# EAGLE design dual-dac-w-32-ch-sh (EAGLE 7.2.0)
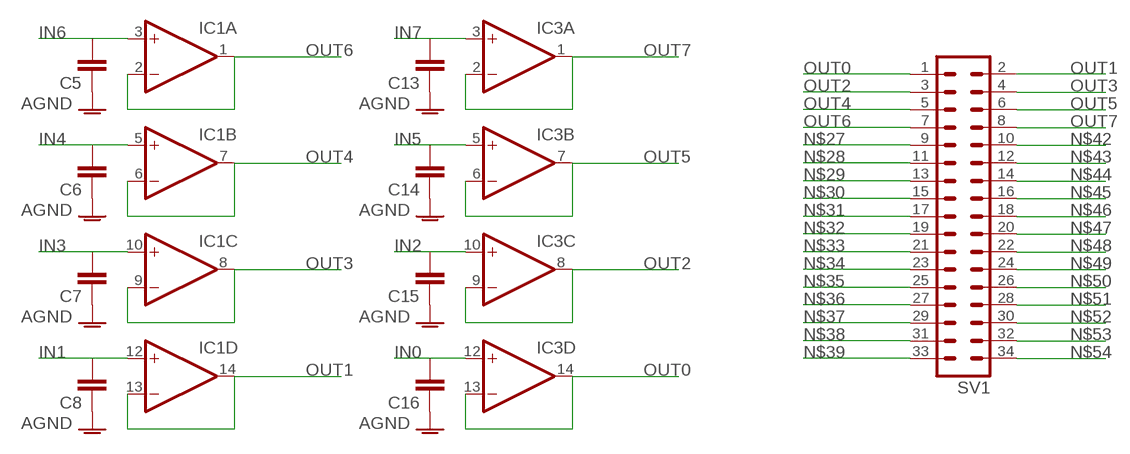
[diagram p0: schematic, sheet 1]

## Parts
C5  C-EUC1206  [C1206]
C6  C-EUC1206  [C1206]
C7  C-EUC1206  [C1206]
C8  C-EUC1206  [C1206]
C13  C-EUC1206  [C1206]
C14  C-EUC1206  [C1206]
C15  C-EUC1206  [C1206]
C16  C-EUC1206  [C1206]
IC1  TL074D  [SO14]
IC3  TL074D  [SO14]
SV1  MA17-2  [MA17-2]

## Nets
AGND: C5.1 C6.1 C7.1 C8.1 C13.1 C14.1 C15.1 C16.1
IN0: C16.2 IC3.12(D:+IN)
IN1: C8.2 IC1.12(D:+IN)
IN2: C15.2 IC3.10(C:+IN)
IN3: C7.2 IC1.10(C:+IN)
IN4: C6.2 IC1.5(B:+IN)
IN5: C14.2 IC3.5(B:+IN)
IN6: C5.2 IC1.3(A:+IN)
IN7: C13.2 IC3.3(A:+IN)
N$27: SV1.9
N$28: SV1.11
N$29: SV1.13
N$30: SV1.15
N$31: SV1.17
N$32: SV1.19
N$33: SV1.21
N$34: SV1.23
N$35: SV1.25
N$36: SV1.27
N$37: SV1.29
N$38: SV1.31
N$39: SV1.33
N$42: SV1.10
N$43: SV1.12
N$44: SV1.14
N$45: SV1.16
N$46: SV1.18
N$47: SV1.20
N$48: SV1.22
N$49: SV1.24
N$50: SV1.26
N$51: SV1.28
N$52: SV1.30
N$53: SV1.32
N$54: SV1.34
OUT0: IC3.13(D:-IN) IC3.14(D:OUT) SV1.1
OUT1: IC1.13(D:-IN) IC1.14(D:OUT) SV1.2
OUT2: IC3.8(C:OUT) IC3.9(C:-IN) SV1.3
OUT3: IC1.8(C:OUT) IC1.9(C:-IN) SV1.4
OUT4: IC1.6(B:-IN) IC1.7(B:OUT) SV1.5
OUT5: IC3.6(B:-IN) IC3.7(B:OUT) SV1.6
OUT6: IC1.1(A:OUT) IC1.2(A:-IN) SV1.7
OUT7: IC3.1(A:OUT) IC3.2(A:-IN) SV1.8

## Power pins joined to a net without a drawn wire
V+: IC1.4(P:V+) IC3.4(P:V+)
V-: IC1.11(P:V-) IC3.11(P:V-)

## Library data of the parts
C5-C8 C13-C16 = resistor:C-EU: CAPACITOR, European symbol
IC1 IC3 = linear:TL074: OP AMP
SV1 = con-lstb:MA17-2: PIN HEADER; OC_FARNELL: unknown; OC_NEWARK: unknown

## Board
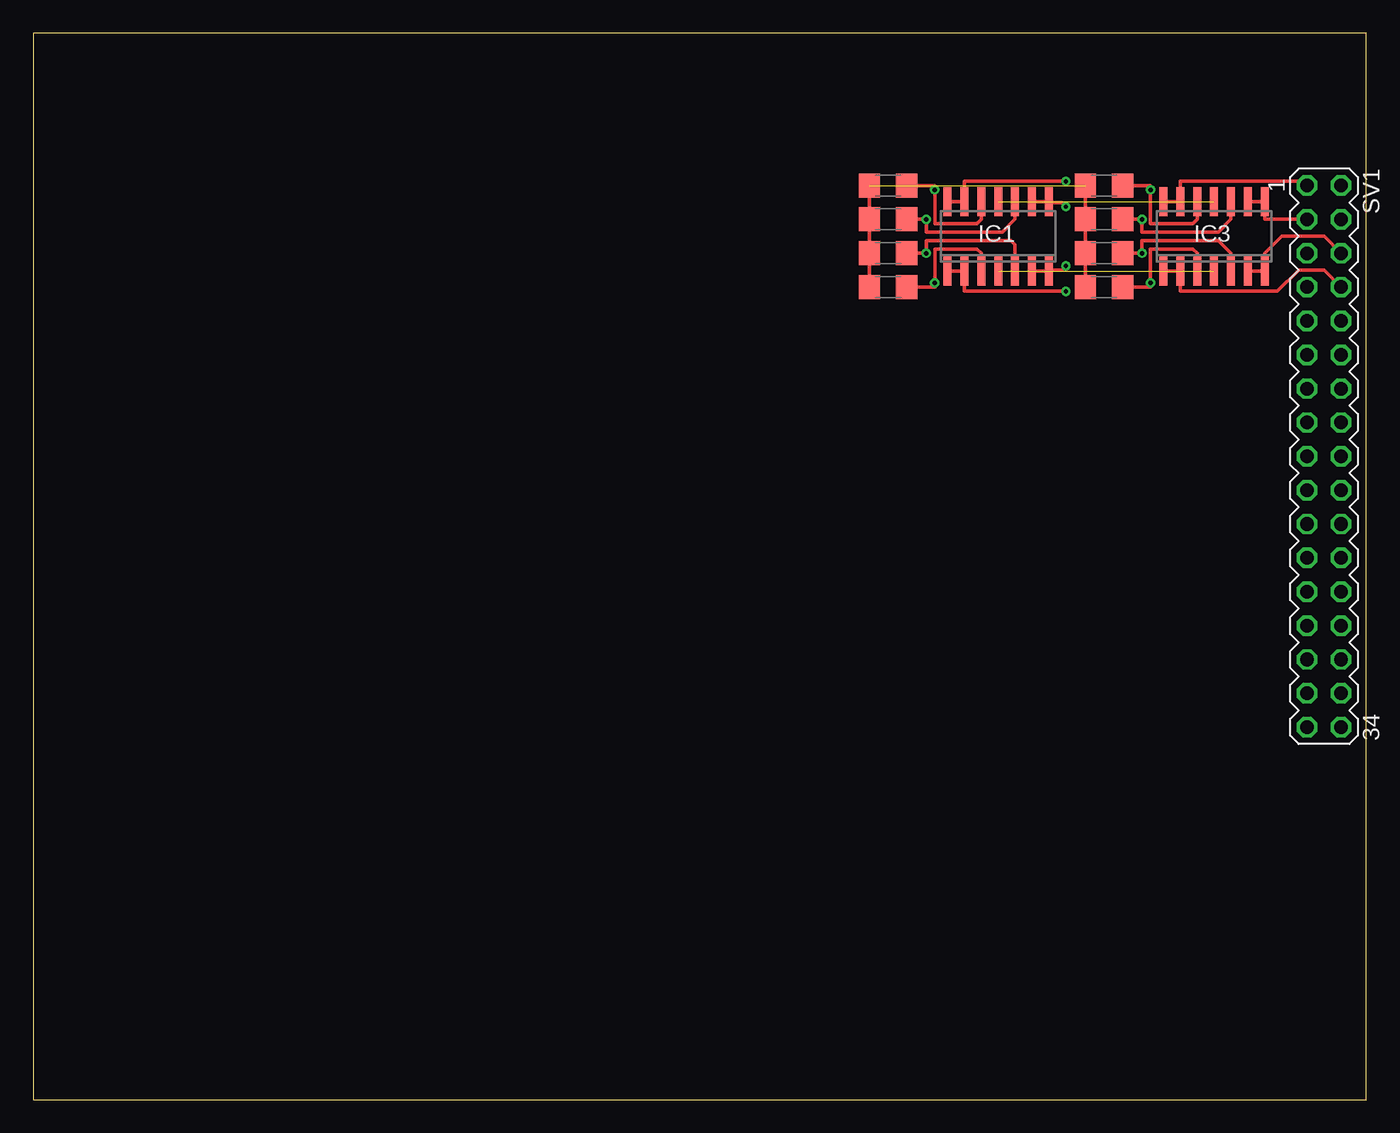
[diagram p1: board, top side]
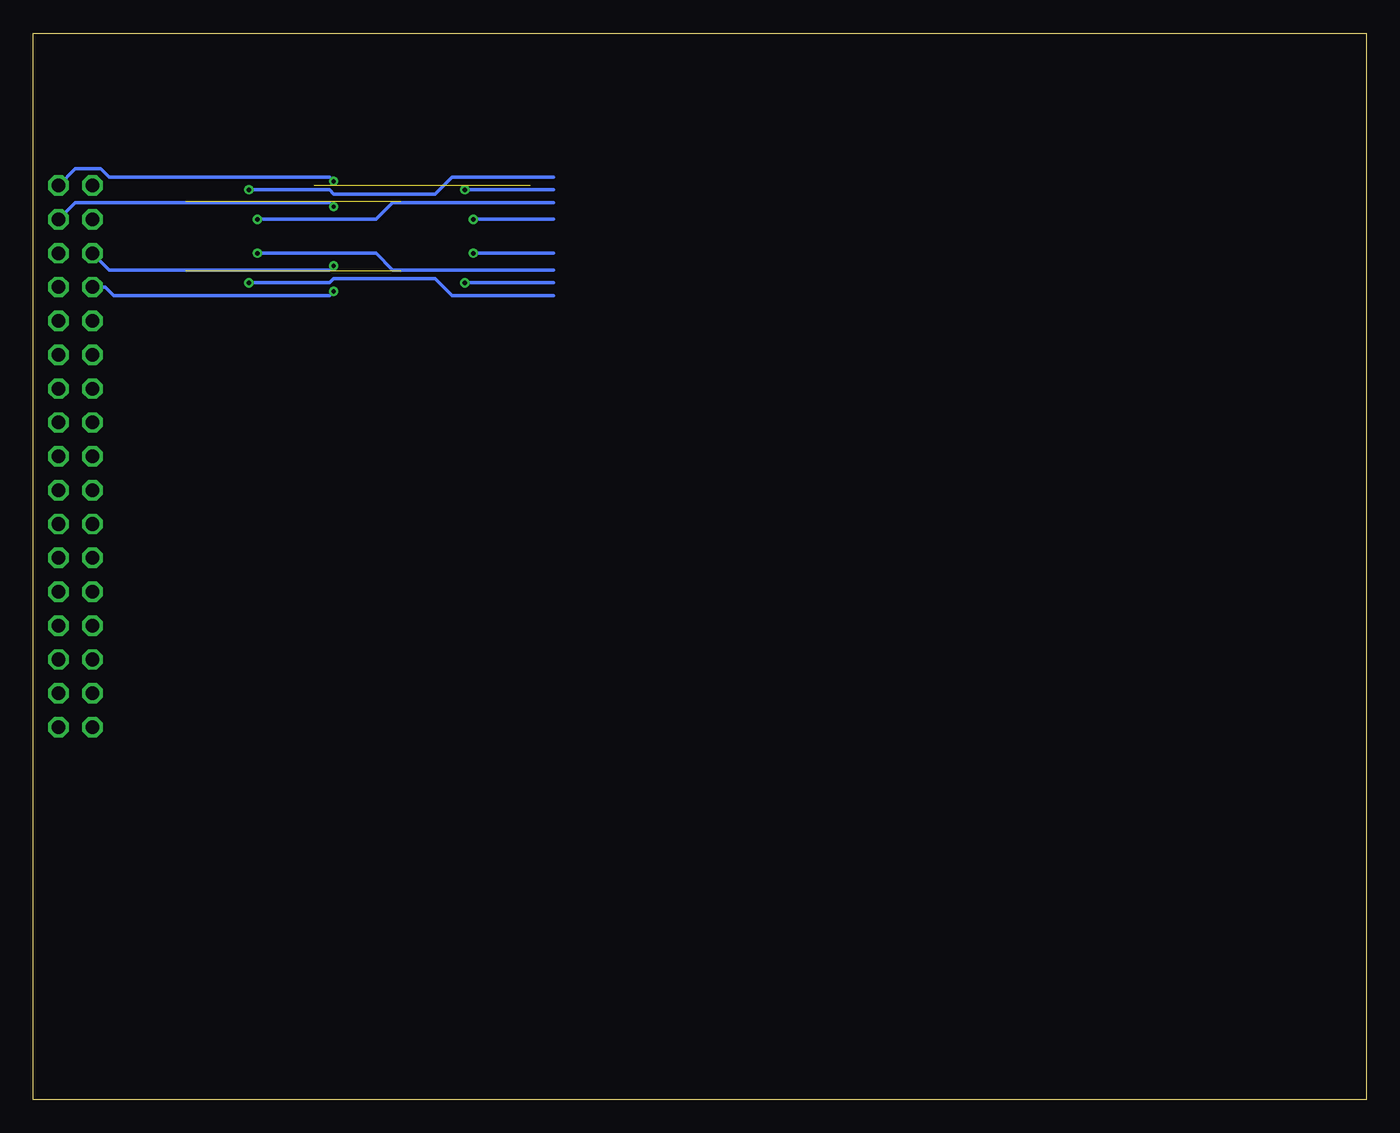
[diagram p2: board, bottom side, seen from below]

Size 100 x 80 mm. Coordinates in mm from the lower left corner, seen from the top.
Outline: 0,0 100,0 100,80 0,80 0,0
Copper layers (1*16): Top 0.0356mm / dielectric 1.5011mm / Bottom 0.0356mm
Design rules "LaenPCBOrder": minimum track width 6mil, minimum drill 13mil, track to track 6mil, track to pad 6mil, pad to pad 6mil, via to via 6mil, smd to smd 6mil, copper to edge 15mil, drill to drill 6mil, minimum pad ring 7mil, minimum via ring 7mil, stop-mask expansion 3mil, vias tented up to drill 0mil, thermal gap 10mil

### Footprints (pad centres in the part's own frame; a part is rotated, then mirrored left to right if it is on the bottom)
C1206 = smd 1.6 x 1.8: 1 -1.4,0; 2 1.4,0
SO14 = smd 0.6 x 2.2: 1 -3.81,-2.6; 2 -2.54,-2.6; 3 -1.27,-2.6; 4 0,-2.6; 5 1.27,-2.6; 6 2.54,-2.6; 7 3.81,-2.6; 8 3.81,2.6; 9 2.54,2.6; 10 1.27,2.6; 11 0,2.6; 12 -1.27,2.6; 13 -2.54,2.6; 14 -3.81,2.6
MA17-2 = drill 1.016 octagon: 1 -20.32,-1.27; 2 -20.32,1.27; 3 -17.78,-1.27; 4 -17.78,1.27; 5 -15.24,-1.27; 6 -15.24,1.27; 7 -12.7,-1.27; 8 -12.7,1.27; 9 -10.16,-1.27; 10 -10.16,1.27; 11 -7.62,-1.27; 12 -7.62,1.27; 13 -5.08,-1.27; 14 -5.08,1.27; 15 -2.54,-1.27; 16 -2.54,1.27; 17 0,-1.27; 18 0,1.27; 19 2.54,-1.27; 20 2.54,1.27; 21 5.08,-1.27; 22 5.08,1.27; 23 7.62,-1.27; 24 7.62,1.27; 25 10.16,-1.27; 26 10.16,1.27; 27 12.7,-1.27; 28 12.7,1.27; 29 15.24,-1.27; 30 15.24,1.27; 31 17.78,-1.27; 32 17.78,1.27; 33 20.32,-1.27; 34 20.32,1.27

### Placement (x,y rotation side)
C5  64.14,60.96 0 top
C6  64.14,63.5 0 top
C7  64.14,66.04 0 top
C8  64.14,68.58 0 top
C13  80.33,60.96 0 top
C14  80.33,63.5 0 top
C15  80.33,66.04 0 top
C16  80.33,68.58 0 top
IC1  72.39,64.77 0 top
IC3  88.58,64.77 0 top
SV1  96.84,48.26 270 top

### Tracks (layer width: path | path; a pad name or v marks a point on that pad's centre or on a via)
AGND  (1 unrouted)
  Top 0.254: C16.1 C15.1 C14.1 C13.1 | C8.1 C7.1 C6.1 C5.1
IN0  (via drill 0.33)
  Top 0.254: IC3.12 87.31,66.04 87,65.72 83.82,65.72 v83.82,68.26 83.82,68.58 C16.2
  Bottom 0.254: v83.82,68.26 77.79,68.26 77.47,67.94 69.85,67.94 68.58,69.22 60.96,69.22
IN1  (via drill 0.33)
  Top 0.254: IC1.12 71.12,66.04 70.8,65.72 67.63,65.72 v67.63,68.26 67.63,68.58 C8.2
  Bottom 0.254: v67.63,68.26 60.96,68.26
IN2  (via drill 0.33)
  Top 0.254: C15.2 82.36,65.91 82.23,66.04 v83.19,66.04 83.19,65.09 88.9,65.09 89.85,66.04 IC3.10
  Bottom 0.254: v83.19,66.04 74.3,66.04 73.03,67.31 60.96,67.31
IN3  (via drill 0.33)
  Top 0.254: IC1.10 73.66,66.04 72.71,65.09 66.99,65.09 v66.99,66.04 C7.2
  Bottom 0.254: v66.99,66.04 60.96,66.04
IN4  (via drill 0.33)
  Top 0.254: 66.17,63.63 C6.2 v66.99,63.5 66.99,64.45 73.34,64.45 73.66,64.14 IC1.5
  Bottom 0.254: v66.99,63.5 60.96,63.5
IN5  (via drill 0.33)
  Top 0.254: 82.36,63.63 C14.2 v83.19,63.5 83.19,64.45 88.9,64.45 89.85,63.5 IC3.5
  Bottom 0.254: v83.19,63.5 74.3,63.5 73.03,62.23 60.96,62.23
IN6  (via drill 0.33)
  Top 0.254: C5.2 67.63,60.96 v67.63,61.28 67.63,63.82 70.8,63.82 71.12,63.5 IC1.3
  Bottom 0.254: v67.63,61.28 60.96,61.28
IN7  (via drill 0.33)
  Top 0.254: IC3.3 87.31,63.5 87,63.82 83.82,63.82 v83.82,61.28 83.82,60.96 C13.2
  Bottom 0.254: v83.82,61.28 77.79,61.28 77.47,61.59 69.85,61.59 68.58,60.33 60.96,60.33
OUT0
  Top 0.254: IC3.14 IC3.13 86.04,68.9 95.25,68.9 SV1.1
OUT1  (via drill 0.33)
  Top 0.254: IC1.14 IC1.13 69.85,68.9 v77.47,68.9
  Bottom 0.254: v77.47,68.9 77.79,69.22 94.3,69.22 94.93,69.85 96.84,69.85 SV1.2
OUT2
  Top 0.254: IC3.9 IC3.8 92.39,66.04 SV1.3
OUT3  (via drill 0.33)
  Top 0.254: IC1.9 IC1.8 76.26,67.31 77.15,67.31 v77.47,66.99
  Bottom 0.254: v77.47,66.99 77.79,67.31 96.84,67.31 SV1.4
OUT4  (via drill 0.33)
  Top 0.254: IC1.6 IC1.7 76.26,62.23 77.15,62.23 v77.47,62.55
  Bottom 0.254: v77.47,62.55 77.79,62.23 94.3,62.23 SV1.5
OUT5
  Top 0.254: SV1.6 96.84,64.77 93.66,64.77 92.39,63.5 IC3.7 IC3.6
OUT6  (via drill 0.33)
  Top 0.254: v77.47,60.64 69.85,60.64 IC1.2 IC1.1
  Bottom 0.254: v77.47,60.64 77.79,60.33 93.98,60.33 94.61,60.96 SV1.7
OUT7
  Top 0.254: SV1.8 96.84,62.23 94.93,62.23 93.34,60.64 86.04,60.64 IC3.2 IC3.1
V+  (1 unrouted)
V-  (1 unrouted)